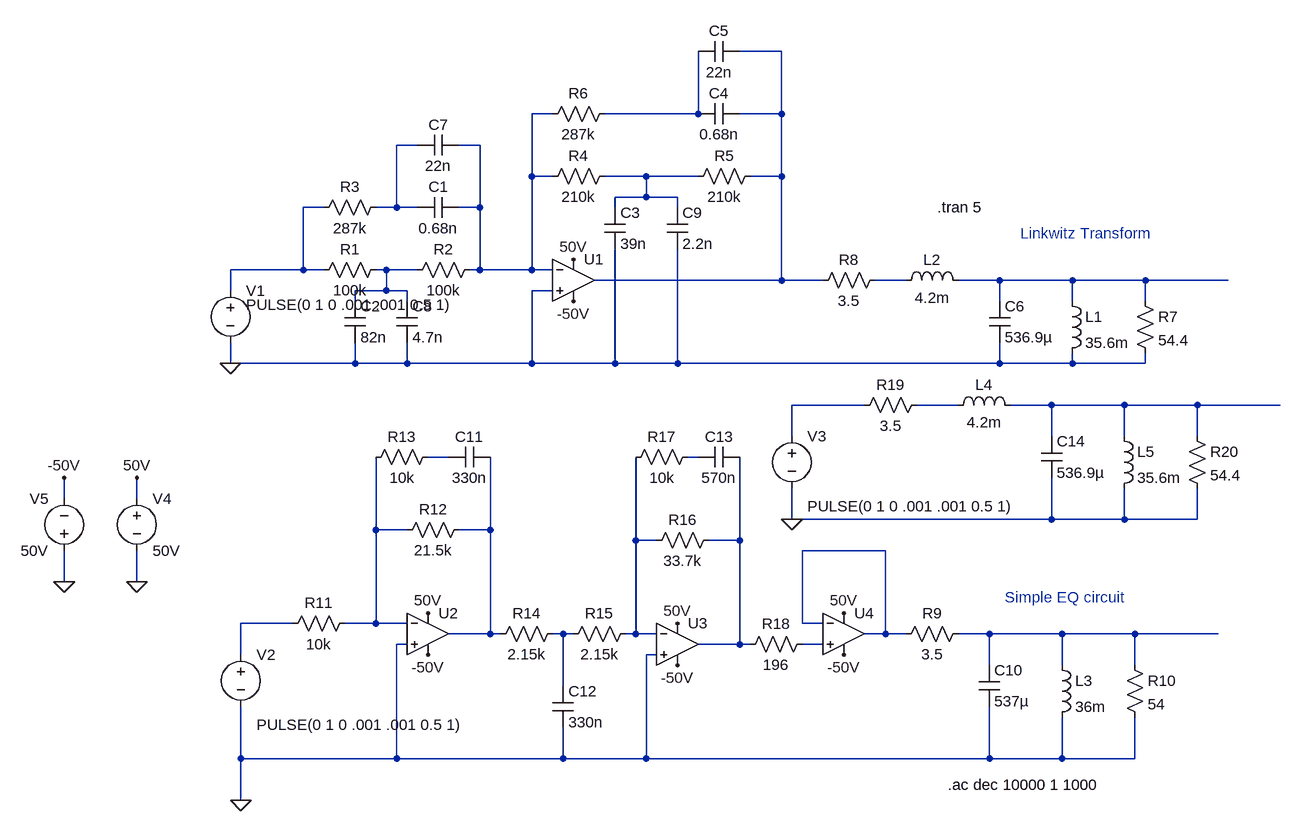
[diagram p0: schematic thor_comp.asc]
thor_comp.asc, the LTspice schematic file:
Version 4
SHEET 1 1268 1076
WIRE 496 -96 432 -96
WIRE 144 0 112 0
WIRE 368 0 368 -96
WIRE 368 0 224 0
WIRE 496 0 496 -96
WIRE 496 0 432 0
WIRE -64 48 -96 48
WIRE 32 48 0 48
WIRE 112 96 112 0
WIRE 144 96 112 96
WIRE 288 96 224 96
WIRE 368 96 288 96
WIRE 496 96 496 0
WIRE 496 96 448 96
WIRE 288 128 288 96
WIRE 288 128 240 128
WIRE 336 128 288 128
WIRE -208 144 -240 144
WIRE -96 144 -96 48
WIRE -96 144 -128 144
WIRE -64 144 -96 144
WIRE 32 144 32 48
WIRE 32 144 0 144
WIRE 240 144 240 128
WIRE 336 144 336 128
WIRE -240 240 -240 144
WIRE -240 240 -352 240
WIRE -208 240 -240 240
WIRE -112 240 -128 240
WIRE -64 240 -112 240
WIRE 32 240 32 144
WIRE 32 240 16 240
WIRE 112 240 112 96
WIRE 112 240 32 240
WIRE 144 240 112 240
WIRE 496 256 496 96
WIRE 496 256 208 256
WIRE 560 256 496 256
WIRE 688 256 640 256
WIRE 832 256 768 256
WIRE 944 256 832 256
WIRE 1056 256 944 256
WIRE 1184 256 1056 256
WIRE -352 272 -352 240
WIRE -112 272 -112 240
WIRE -112 272 -160 272
WIRE -80 272 -112 272
WIRE 144 272 112 272
WIRE -160 288 -160 272
WIRE -80 288 -80 272
WIRE 832 288 832 256
WIRE 944 288 944 256
WIRE 1056 288 1056 256
WIRE -352 384 -352 352
WIRE -160 384 -160 352
WIRE -160 384 -352 384
WIRE -80 384 -80 352
WIRE -80 384 -160 384
WIRE 112 384 112 272
WIRE 112 384 -80 384
WIRE 240 384 240 208
WIRE 240 384 112 384
WIRE 336 384 336 208
WIRE 336 384 240 384
WIRE 832 384 832 352
WIRE 832 384 336 384
WIRE 944 384 944 368
WIRE 944 384 832 384
WIRE 1056 384 1056 368
WIRE 1056 384 944 384
WIRE 624 448 512 448
WIRE 768 448 704 448
WIRE 912 448 848 448
WIRE 1024 448 912 448
WIRE 1136 448 1024 448
WIRE 1264 448 1136 448
WIRE 512 496 512 448
WIRE 912 496 912 448
WIRE 1024 496 1024 448
WIRE 1136 496 1136 448
WIRE -16 528 -48 528
WIRE 368 528 352 528
WIRE -608 592 -608 560
WIRE -496 592 -496 560
WIRE 512 624 512 576
WIRE 912 624 912 560
WIRE 912 624 512 624
WIRE 1024 624 1024 576
WIRE 1024 624 912 624
WIRE 1136 624 1136 576
WIRE 1136 624 1024 624
WIRE -128 640 -128 528
WIRE -80 640 -128 640
WIRE 48 640 48 528
WIRE 48 640 0 640
WIRE 272 656 272 528
WIRE 304 656 272 656
WIRE 432 656 432 528
WIRE 432 656 384 656
WIRE 656 672 528 672
WIRE -608 720 -608 672
WIRE -496 720 -496 672
WIRE -256 784 -336 784
WIRE -128 784 -128 640
WIRE -128 784 -176 784
WIRE -80 784 -128 784
WIRE 528 784 528 672
WIRE 560 784 528 784
WIRE 48 800 48 640
WIRE 48 800 -16 800
WIRE 64 800 48 800
WIRE 160 800 144 800
WIRE 176 800 160 800
WIRE 272 800 272 656
WIRE 272 800 256 800
WIRE 304 800 272 800
WIRE 656 800 656 672
WIRE 656 800 624 800
WIRE 688 800 656 800
WIRE 816 800 768 800
WIRE 928 800 816 800
WIRE 1040 800 928 800
WIRE 1168 800 1040 800
WIRE -80 816 -96 816
WIRE 432 816 432 656
WIRE 432 816 368 816
WIRE 448 816 432 816
WIRE 560 816 528 816
WIRE -336 832 -336 784
WIRE 304 832 288 832
WIRE 816 848 816 800
WIRE 928 848 928 800
WIRE 1040 848 1040 800
WIRE 160 880 160 800
WIRE -336 992 -336 912
WIRE -96 992 -96 816
WIRE -96 992 -336 992
WIRE 160 992 160 944
WIRE 160 992 -96 992
WIRE 288 992 288 832
WIRE 288 992 160 992
WIRE 816 992 816 912
WIRE 816 992 288 992
WIRE 928 992 928 928
WIRE 928 992 816 992
WIRE 1040 992 1040 928
WIRE 1040 992 928 992
WIRE -336 1056 -336 992
FLAG -352 384 0
FLAG 176 224 50V
FLAG 176 288 -50V
FLAG -336 1056 0
FLAG -48 768 50V
FLAG 336 784 50V
FLAG 592 768 50V
FLAG -48 832 -50V
FLAG 336 848 -50V
FLAG 592 832 -50V
FLAG 512 624 0
FLAG -496 560 50V
FLAG -608 560 -50V
FLAG -608 720 0
FLAG -496 720 0
SYMBOL res -112 224 R90
WINDOW 0 0 56 VBottom 2
WINDOW 3 32 56 VTop 2
SYMATTR InstName R1
SYMATTR Value 100k
SYMBOL res 32 224 R90
WINDOW 0 0 56 VBottom 2
WINDOW 3 32 56 VTop 2
SYMATTR InstName R2
SYMATTR Value 100k
SYMBOL res -112 128 R90
WINDOW 0 0 56 VBottom 2
WINDOW 3 32 56 VTop 2
SYMATTR InstName R3
SYMATTR Value 287k
SYMBOL cap 0 128 R90
WINDOW 0 0 32 VBottom 2
WINDOW 3 32 32 VTop 2
SYMATTR InstName C1
SYMATTR Value 0.68n
SYMBOL Opamps/UniversalOpamp2 176 256 R0
SYMATTR InstName U1
SYMBOL cap -176 288 R0
SYMATTR InstName C2
SYMATTR Value 82n
SYMBOL res 240 80 R90
WINDOW 0 0 56 VBottom 2
WINDOW 3 32 56 VTop 2
SYMATTR InstName R4
SYMATTR Value 210k
SYMBOL cap 224 144 R0
SYMATTR InstName C3
SYMATTR Value 39n
SYMBOL res 464 80 R90
WINDOW 0 0 56 VBottom 2
WINDOW 3 32 56 VTop 2
SYMATTR InstName R5
SYMATTR Value 210k
SYMBOL res 240 -16 R90
WINDOW 0 0 56 VBottom 2
WINDOW 3 32 56 VTop 2
SYMATTR InstName R6
SYMATTR Value 287k
SYMBOL cap 432 -16 R90
WINDOW 0 0 32 VBottom 2
WINDOW 3 32 32 VTop 2
SYMATTR InstName C4
SYMATTR Value 0.68n
SYMBOL cap 432 -112 R90
WINDOW 0 0 32 VBottom 2
WINDOW 3 32 32 VTop 2
SYMATTR InstName C5
SYMATTR Value 22n
SYMBOL cap 816 288 R0
SYMATTR InstName C6
SYMATTR Value 536.9µ
SYMBOL ind 928 272 R0
SYMATTR InstName L1
SYMATTR Value 35.6m
SYMBOL res 1040 272 R0
SYMATTR InstName R7
SYMATTR Value 54.4
SYMBOL res 656 240 R90
WINDOW 0 0 56 VBottom 2
WINDOW 3 32 56 VTop 2
SYMATTR InstName R8
SYMATTR Value 3.5
SYMBOL voltage -352 256 R0
WINDOW 123 24 38 Left 2
WINDOW 39 0 0 Left 0
WINDOW 3 24 60 Left 2
SYMATTR Value2 PULSE(0 1 0 .001 .001 0.5 1)
SYMATTR Value ""
SYMATTR InstName V1
SYMBOL cap 0 32 R90
WINDOW 0 0 32 VBottom 2
WINDOW 3 32 32 VTop 2
SYMATTR InstName C7
SYMATTR Value 22n
SYMBOL cap -96 288 R0
SYMATTR InstName C8
SYMATTR Value 4.7n
SYMBOL cap 320 144 R0
SYMATTR InstName C9
SYMATTR Value 2.2n
SYMBOL ind 784 272 M270
WINDOW 0 32 56 VTop 2
WINDOW 3 5 56 VBottom 2
SYMATTR InstName L2
SYMATTR Value 4.2m
SYMBOL voltage -336 816 R0
WINDOW 123 24 124 Left 2
WINDOW 39 0 0 Left 0
SYMATTR Value2 PULSE(0 1 0 .001 .001 0.5 1)
SYMATTR InstName V2
SYMATTR Value ""
SYMBOL res 784 784 R90
WINDOW 0 0 56 VBottom 2
WINDOW 3 32 56 VTop 2
SYMATTR InstName R9
SYMATTR Value 3.5
SYMBOL cap 800 848 R0
SYMATTR InstName C10
SYMATTR Value 537µ
SYMBOL ind 912 832 R0
SYMATTR InstName L3
SYMATTR Value 36m
SYMBOL res 1024 832 R0
SYMATTR InstName R10
SYMATTR Value 54
SYMBOL res -160 768 R90
WINDOW 0 0 56 VBottom 2
WINDOW 3 32 56 VTop 2
SYMATTR InstName R11
SYMATTR Value 10k
SYMBOL res 16 624 R90
WINDOW 0 0 56 VBottom 2
WINDOW 3 32 56 VTop 2
SYMATTR InstName R12
SYMATTR Value 21.5k
SYMBOL cap 48 512 R90
WINDOW 0 0 32 VBottom 2
WINDOW 3 32 32 VTop 2
SYMATTR InstName C11
SYMATTR Value 330n
SYMBOL res -32 512 R90
WINDOW 0 0 56 VBottom 2
WINDOW 3 32 56 VTop 2
SYMATTR InstName R13
SYMATTR Value 10k
SYMBOL res 160 784 R90
WINDOW 0 0 56 VBottom 2
WINDOW 3 32 56 VTop 2
SYMATTR InstName R14
SYMATTR Value 2.15k
SYMBOL res 272 784 R90
WINDOW 0 0 56 VBottom 2
WINDOW 3 32 56 VTop 2
SYMATTR InstName R15
SYMATTR Value 2.15k
SYMBOL cap 144 880 R0
SYMATTR InstName C12
SYMATTR Value 330n
SYMBOL res 400 640 R90
WINDOW 0 0 56 VBottom 2
WINDOW 3 32 56 VTop 2
SYMATTR InstName R16
SYMATTR Value 33.7k
SYMBOL res 368 512 R90
WINDOW 0 0 56 VBottom 2
WINDOW 3 32 56 VTop 2
SYMATTR InstName R17
SYMATTR Value 10k
SYMBOL cap 432 512 R90
WINDOW 0 0 32 VBottom 2
WINDOW 3 32 32 VTop 2
SYMATTR InstName C13
SYMATTR Value 570n
SYMBOL res 544 800 R90
WINDOW 0 0 56 VBottom 2
WINDOW 3 32 56 VTop 2
SYMATTR InstName R18
SYMATTR Value 196
SYMBOL UniversalOpamp2 -48 800 R0
SYMATTR InstName U2
SYMBOL UniversalOpamp2 336 816 R0
SYMATTR InstName U3
SYMBOL Opamps/UniversalOpamp2 592 800 R0
SYMATTR InstName U4
SYMBOL voltage 512 480 R0
WINDOW 123 24 124 Left 2
WINDOW 39 0 0 Left 0
SYMATTR Value2 PULSE(0 1 0 .001 .001 0.5 1)
SYMATTR InstName V3
SYMATTR Value ""
SYMBOL res 720 432 R90
WINDOW 0 0 56 VBottom 2
WINDOW 3 32 56 VTop 2
SYMATTR InstName R19
SYMATTR Value 3.5
SYMBOL ind 752 464 R270
WINDOW 0 32 56 VTop 2
WINDOW 3 5 56 VBottom 2
SYMATTR InstName L4
SYMATTR Value 4.2m
SYMBOL cap 896 496 R0
SYMATTR InstName C14
SYMATTR Value 536.9µ
SYMBOL ind 1008 480 R0
SYMATTR InstName L5
SYMATTR Value 35.6m
SYMBOL res 1120 480 R0
SYMATTR InstName R20
SYMATTR Value 54.4
SYMBOL voltage -496 576 R0
SYMATTR InstName V4
SYMATTR Value 50V
SYMBOL voltage -608 688 R180
WINDOW 0 24 96 Left 2
WINDOW 3 24 16 Left 2
SYMATTR InstName V5
SYMATTR Value 50V
TEXT 752 1032 Left 2 !.ac dec 10000 1 1000
TEXT 840 744 Left 2 ;Simple EQ circuit
TEXT 864 184 Left 2 ;Linkwitz Transform
TEXT 736 144 Left 2 !.tran 5

The netlist it stands for:
* thor_comp.asc
R1 N007 N006 100k
R2 N002 N007 100k
R3 N004 N006 287k
C1 N002 N004 0.68n
XU1 0 N002 50V -50V N001 level.2 Avol=1Meg GBW=10Meg Slew=10Meg ilimit=25m rail=0 Vos=0 phimargin=45 en=0 enk=0 in=0 ink=0 Rin=500Meg  ; pins IN+ IN- V+ V- OUT
C2 N007 0 82n
R4 N005 N002 210k
C3 N005 0 39n
R5 N001 N005 210k
R6 N003 N002 287k
C4 N001 N003 0.68n
C5 N001 N003 22n
C6 N009 0 536.9µ
L1 N009 0 35.6m
R7 N009 0 54.4
R8 N008 N001 3.5
V1 N006 0 PULSE(0 1 0 .001 .001 0.5 1)
C7 N002 N004 22n
C8 N007 0 4.7n
C9 N005 0 2.2n
L2 N009 N008 4.2m
V2 N020 0 PULSE(0 1 0 .001 .001 0.5 1)
R9 N022 N019 3.5
C10 N022 0 537µ
L3 N022 0 36m
R10 N022 0 54
R11 N015 N020 10k
R12 N016 N015 21.5k
C11 N016 N013 330n
R13 N013 N015 10k
R14 N021 N016 2.15k
R15 N017 N021 2.15k
C12 N021 0 330n
R16 N018 N017 33.7k
R17 N014 N017 10k
C13 N018 N014 570n
R18 N023 N018 196
XU2 0 N015 50V -50V N016 level.2 Avol=1Meg GBW=10Meg Slew=10Meg ilimit=25m rail=0 Vos=0 phimargin=45 en=0 enk=0 in=0 ink=0 Rin=500Meg  ; pins IN+ IN- V+ V- OUT
XU3 0 N017 50V -50V N018 level.2 Avol=1Meg GBW=10Meg Slew=10Meg ilimit=25m rail=0 Vos=0 phimargin=45 en=0 enk=0 in=0 ink=0 Rin=500Meg  ; pins IN+ IN- V+ V- OUT
XU4 N023 N019 50V -50V N019 level.2 Avol=1Meg GBW=10Meg Slew=10Meg ilimit=25m rail=0 Vos=0 phimargin=45 en=0 enk=0 in=0 ink=0 Rin=500Meg  ; pins IN+ IN- V+ V- OUT
V3 N010 0 PULSE(0 1 0 .001 .001 0.5 1)
R19 N011 N010 3.5
L4 N011 N012 4.2m
C14 N012 0 536.9µ
L5 N012 0 35.6m
R20 N012 0 54.4
V4 50V 0 50V
V5 0 -50V 50V
.ac dec 10000 1 1000
* Simple EQ circuit
* Linkwitz Transform
.tran 5
.lib UniversalOpamps2.sub
.backanno
.end